# Altium schematic sheet TR.SchDoc
size A
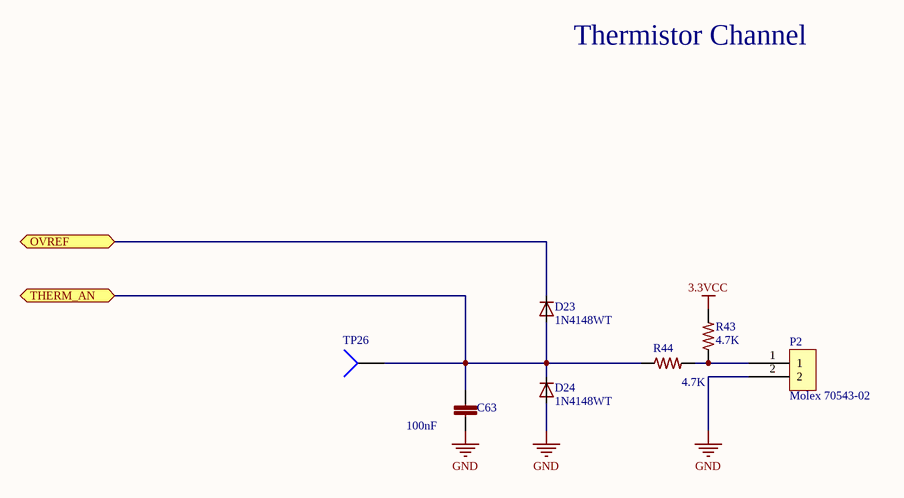
[diagram p0: TR.SchDoc]

## Parts
C63  100nF  [C0402]
D23  1N4148WT  [SOD523]
D24  1N4148WT  [SOD523]
P2  Molex 70543-02  [70543-02]
R43  4.7K  [R0603]
R44  4.7K  [R0603]
TP26  TP4  [TP-2]  (value not drawn)

## Ports
OVREF, THERM_AN

## Nets
3.3VCC: R43.2
GND: C63.2 D24.A P2.2
OVREF: D23.C ; port OVREF
THERM_AN: C63.1 D23.A D24.C R44.1 TP26.1 ; port THERM_AN
NetP2_1: P2.1 R43.1 R44.2

## Notes on the sheet
- Thermistor Channel

## Library data of the parts
C63 = GRM155R71C104KA88D: CAP CER 0402 100nF 16V 10% X7R; LastRevisionNote: ImportComponents; Published: 23-Apr-2014; Publisher: UltiMachine; LastRevisionDate: 23-Apr-2014; ManufacturerPartNumber: GRM155R71C104KA88D; VALUE: 100nF
D23 D24 = 1N4148WT: DIODE SOD523; LastRevisionNote: ImportComponents; Published: 23-Apr-2014; Publisher: UltiMachine; LastRevisionDate: 23-Apr-2014; Value: 1N4148WT
R43 R44 = ERJ3EKF4701V: RES 0603 4.7K 100mW 1%; LastRevisionNote: ImportComponents; Published: 23-Apr-2014; Publisher: UltiMachine; LastRevisionDate: 23-Apr-2014; ManufacturerPartNumber: ERJ3EKF4701V; VALUE: 4.7K
TP26 = Socket: LatestRevisionDate: 17-Jul-2002; LatestRevisionNote: Re-released for DXP Platform.; Publisher: Altium Limited